# Altium schematic sheet HTparametros.SchDoc
size Letter; SheetNumber: 5; SheetTotal: 5
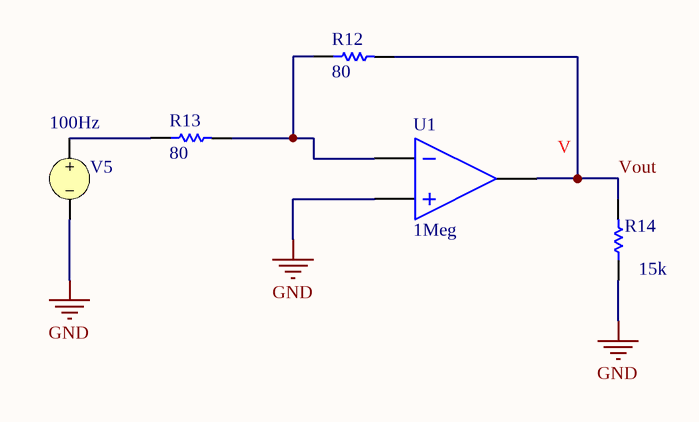
[diagram p0: HTparametros.SchDoc]

## Parts
R12  value 80  (hidden comment: Resistor)
R13  value 80  (hidden comment: Resistor)
R14  value 15k  (hidden comment: Resistor)
U1  GAIN: 1Meg  (hidden comment: Ideal Operational Amplifier)
V5  Frequency: 100Hz  (hidden comment: SIN(0 1 100Hz 0 0 0))

## Nets
GND: R14.1 U1.2(IN+) V5.2
Vout: R12.2 R14.2 U1.3(OUT)
NetR12_1: R12.1 R13.2 U1.1(IN-)
NetR13_1: R13.1 V5.1

## Notes on the sheet
- Proyecto:
- Documento:
- Autor:
- Carnet:
- Fecha:
- Revisión:
- Curso:
- Tamaño:
- Hoja:
- de
- Carta

## Library data of the parts
R12-R14 = Resistor: TC1: 0; SimulationGenericComponent: True; TC2: 0
U1 = OpAmp: SimulationGenericComponent: True
V5 = VSRC: Voltage Source; Note: PCB Footprint - Not required; AC Magnitude: 1; AC Phase: 0; DC Magnitude: 5; Published: 8-Jun-2000; LatestRevisionDate: 17-Jul-2002; LatestRevisionNote: Re-released for DXP Platform.; PackageReference: Not Applicable; Publisher: Altium Limited; Offset: 0; Delay: 0; Damping Factor: 0; Phase: 0; Amplitude: 1